# Altium project led.PrjPCB
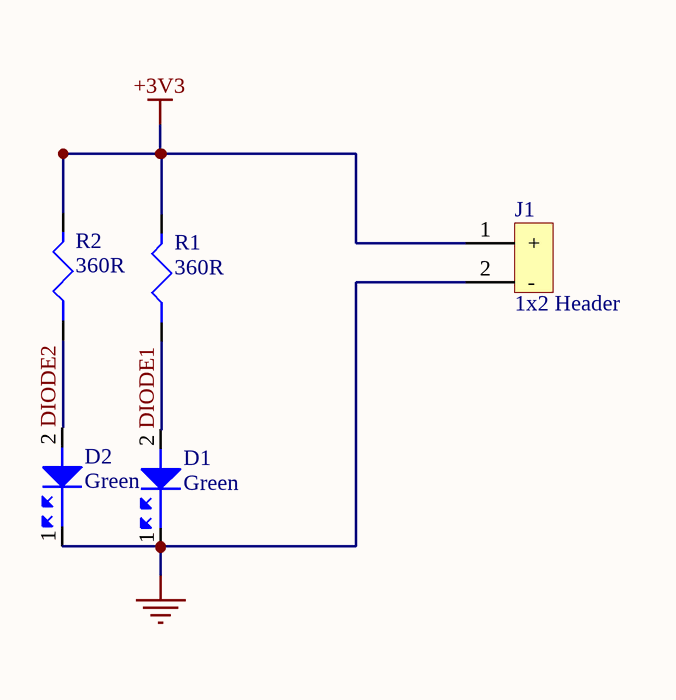
[diagram p0: LED.SchDoc]
1 sheet, 5 parts. Net scope: global (net labels, ports and power ports of the same name join across sheets).
Board file: PCB1.PcbDoc

## Sheet LED.SchDoc
size A4

### Parts
D1  Green  [LED0603G]
D2  Green  [LED0603G]
J1  1x2 Header  [HEADER1x2]
R1  360R  [R0805]
R2  360R  [R0805]

### Nets
+3V3: J1.1(+) R1.2 R2.2
GND: D1.1 D2.1 J1.2(-)
DIODE1: D1.2 R1.1
DIODE2: D2.2 R2.1

### Library data of the parts
D1 D2 = SML-LXFM0603SUGCTR: Super Ultra Green 1.6 x 0.8 mm 120° Water Clear 50 mcd 2.2 V Surface Mount LED; Manufacturer: Lumex; Forward Voltage: 2.2V; Forward Current: 20mA; Power Rating: 105mW; Luminous Intensity: 50mcd; Supplier 1: Digi-Key; Supplier Part Number 1: 67-2320-6-ND; Manufacturer Part Number: SML-LXFM0603SUGCTR; Stock 1: 27636; Pricing 1: 1=1.04, 10=0.676, 100=0.4431, 1000=0.3498 (USD); Mount: Surface Mount; Case/Package: 0603; Color: Green; Min Operating Temperature: -40°C; Max Operating Temperature: 85°C; Lens Style: Clear; Viewing Angle: 120°; Package Quantity: 2000; Illumination Color: Green; Packaging: Tape and Reel; Lead Free: Lead Free; RoHS Compliant: Yes; ComponentLink1URL: http://www.mouser.com/ds/2/244/SML-LXFM0603SUGCTR-115255.pdf?src-supplier=Mouser; ComponentLink1Description: http://www.mouser.com/ds/2/244/SML-LXFM0603SUGCTR-115255.pdf?src-supplier=Mouser; ComponentLink2URL: http://www.lumex.com/specs/SML-LXFM0603SUGCTR.pdf?src-supplier=Future+Electronics; ComponentLink2Description: http://www.lumex.com/specs/SML-LXFM0603SUGCTR.pdf?src-supplier=Future+Electronics; Category: Optoelectronics
J1 = 22-27-2021: CONN HEADER 2POS .100 VERT TIN; Manufacturer: Molex; Number of Positions: 2; Contact Resistance: 20mR; Current Rating: 4A; Voltage Rating: 500V; Gender: Male; Voltage Rating (AC): 250V; Insulation Resistance: 50GR; Pitch: 2.54mm; Approvals: UL,CSA; Categories: Connectors; Supplier 1: Digi-Key; Manufacturer Part Number: 22-27-2021; Stock 1: 35556; Pricing 1: 1=0.29, 10=0.232, 100=0.1702, 1000=0.1354, 5000=0.1161, 10000=0.1083 (USD); Mount: Through Hole; Color: White; Housing Color: Natural; Housing Material: Nylon; Contact Plating: Tin; Contact Material: Tin; Material: Nylon; Weight: 0.00769oz; Min Operating Temperature: 0°C; Max Operating Temperature: 75°C; Number of Rows: 1; Packaging: Bulk; Termination: Through Hole; Orientation: Straight; Series: 6410; Number of Contacts: 2; Contact Type: -; Package Quantity: 24000; Contact Gender: Male; Number of Circuits: 2; Max Current Rating: 4A; Working Voltage: 250V; Voltage Rating (DC): 250V; Length: 10.16mm; Height: 11.7mm; Depth: 5.8mm; Lead Pitch: 2.54mm; Radiation Hardening: No; RoHS Compliant: Yes; Lead Free: Lead Free; Flammability Rating: UL94 V-0; REACH SVHC: Unknown; ComponentLink1URL: https://www.verical.com/server-webapp/html/getDatasheet?partID=163454&src-supplier=Verical; ComponentLink1Description: https://www.verical.com/server-webapp/html/getDatasheet?partID=163454&src-supplier=Verical; ComponentLink2URL: http://www.molex.com/webdocs/datasheets/pdf/en-us/0022272021_PCB_HEADERS.pdf?src-supplier=Avnet; ComponentLink2Description: http://www.molex.com/webdocs/datasheets/pdf/en-us/0022272021_PCB_HEADERS.pdf?src-supplier=Avnet; ComponentLink3URL: http://uk.rs-online.com/webdocs/13c2/0900766b813c2e6e.pdf?src-supplier=RSComponents; ComponentLink3Description: http://uk.rs-online.com/webdocs/13c2/0900766b813c2e6e.pdf?src-supplier=RSComponents; ComponentLink4URL: http://www.farnell.com/datasheets/2305438.pdf?src-supplier=Mouser; ComponentLink4Description: http://www.farnell.com/datasheets/2305438.pdf?src-supplier=Mouser; ComponentLink5URL: http://www.farnell.com/datasheets/2305438.pdf?src-supplier=Jameco; ComponentLink5Description: http://www.farnell.com/datasheets/2305438.pdf?src-supplier=Jameco; Supplier Part Number 1: WM4111-ND
R1 R2 = CRCW0805360RFKEA: Res Thick Film 0805 360 Ohm 1% 1/8W ±100ppm/°C Molded SMD SMD Paper T/R; Manufacturer: Vishay; Number of Terminals/Pins: 2; Max Power Dissipation: 125mW; Voltage Rating (DC): 150V; Supplier 1: Digi-Key; Supplier Part Number 1: 541-360CCT-ND; Manufacturer Part Number: CRCW0805360RFKEA; Stock 1: 0; Pricing 1: 1=0.1, 10=0.067, 100=0.0271, 1000=0.0122, 2500=0.0106 (USD); Case/Package: 0805; Number of Pins: 2; Case Code (Metric): 2012; Case Code (Imperial): 0805; Contact Plating: Tin; Weight: 0.000194oz; Min Operating Temperature: -55°C; Max Operating Temperature: 155°C; Resistance: 360R; Tolerance: 1%; Packaging: Cut Tape; Resistor Type: Thick Film; Package Quantity: 5000; Number of Terminations: 2; Temperature Coefficient: 100ppm/°C; Features: Automotive AEC-Q200; Series: D/CRCW E3; Power Rating: 125mW; Voltage Rating: 150V; Termination: SMD/SMT; Technology: THICK FILM; Length: 2mm; Width: 1.25mm; Height: 0.45mm; Depth: 1.25mm; Radiation Hardening: No; Lead Free: Lead Free; RoHS Compliant: Yes; REACH SVHC: Unknown; Military Standard: Not; ComponentLink1URL: http://www.vishay.com/docs/20035/dcrcwe3.pdf?src-supplier=Digi-Key; ComponentLink1Description: http://www.vishay.com/docs/20035/dcrcwe3.pdf?src-supplier=Digi-Key; Category: Resistors

## Assembly variants
LED Not Fitted: not fitted D2 R2